# EAGLE design battery_monitor_6803-2_Rev4-uno_shield (EAGLE 6.3)
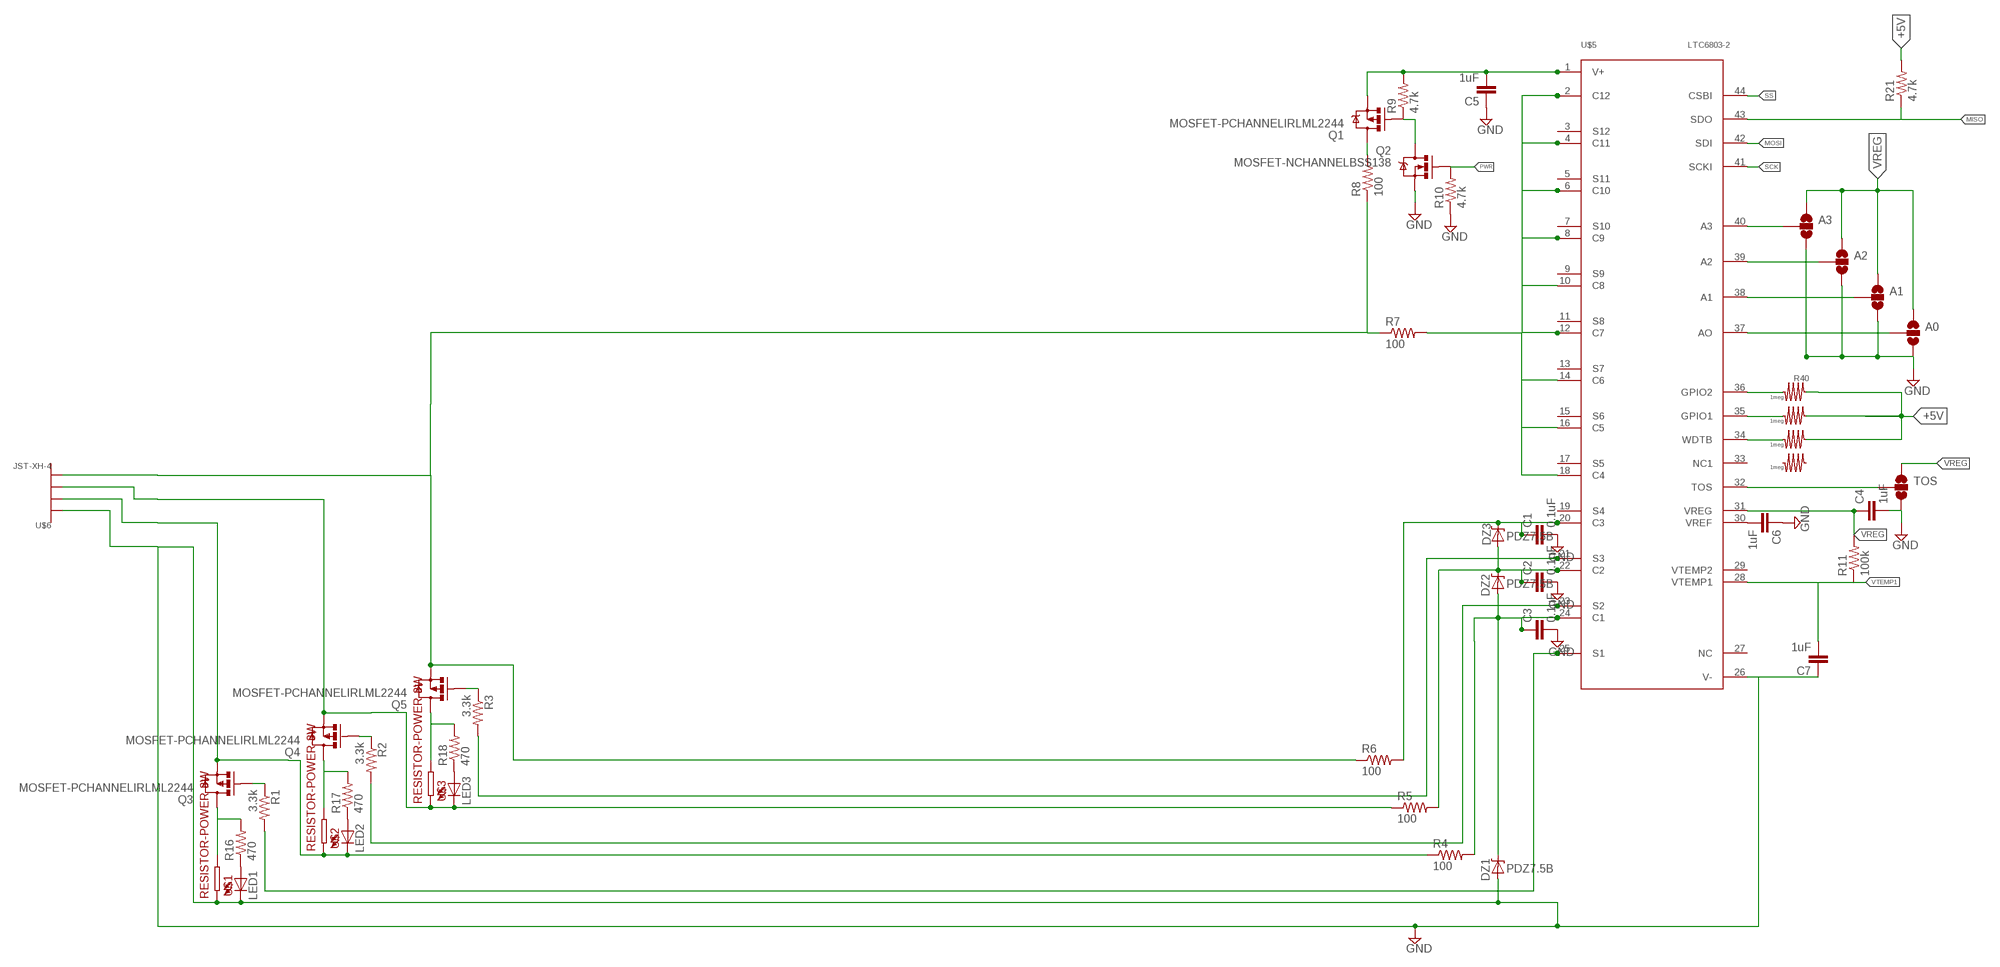
[diagram p0: schematic, sheet 1, part 1 of 2]
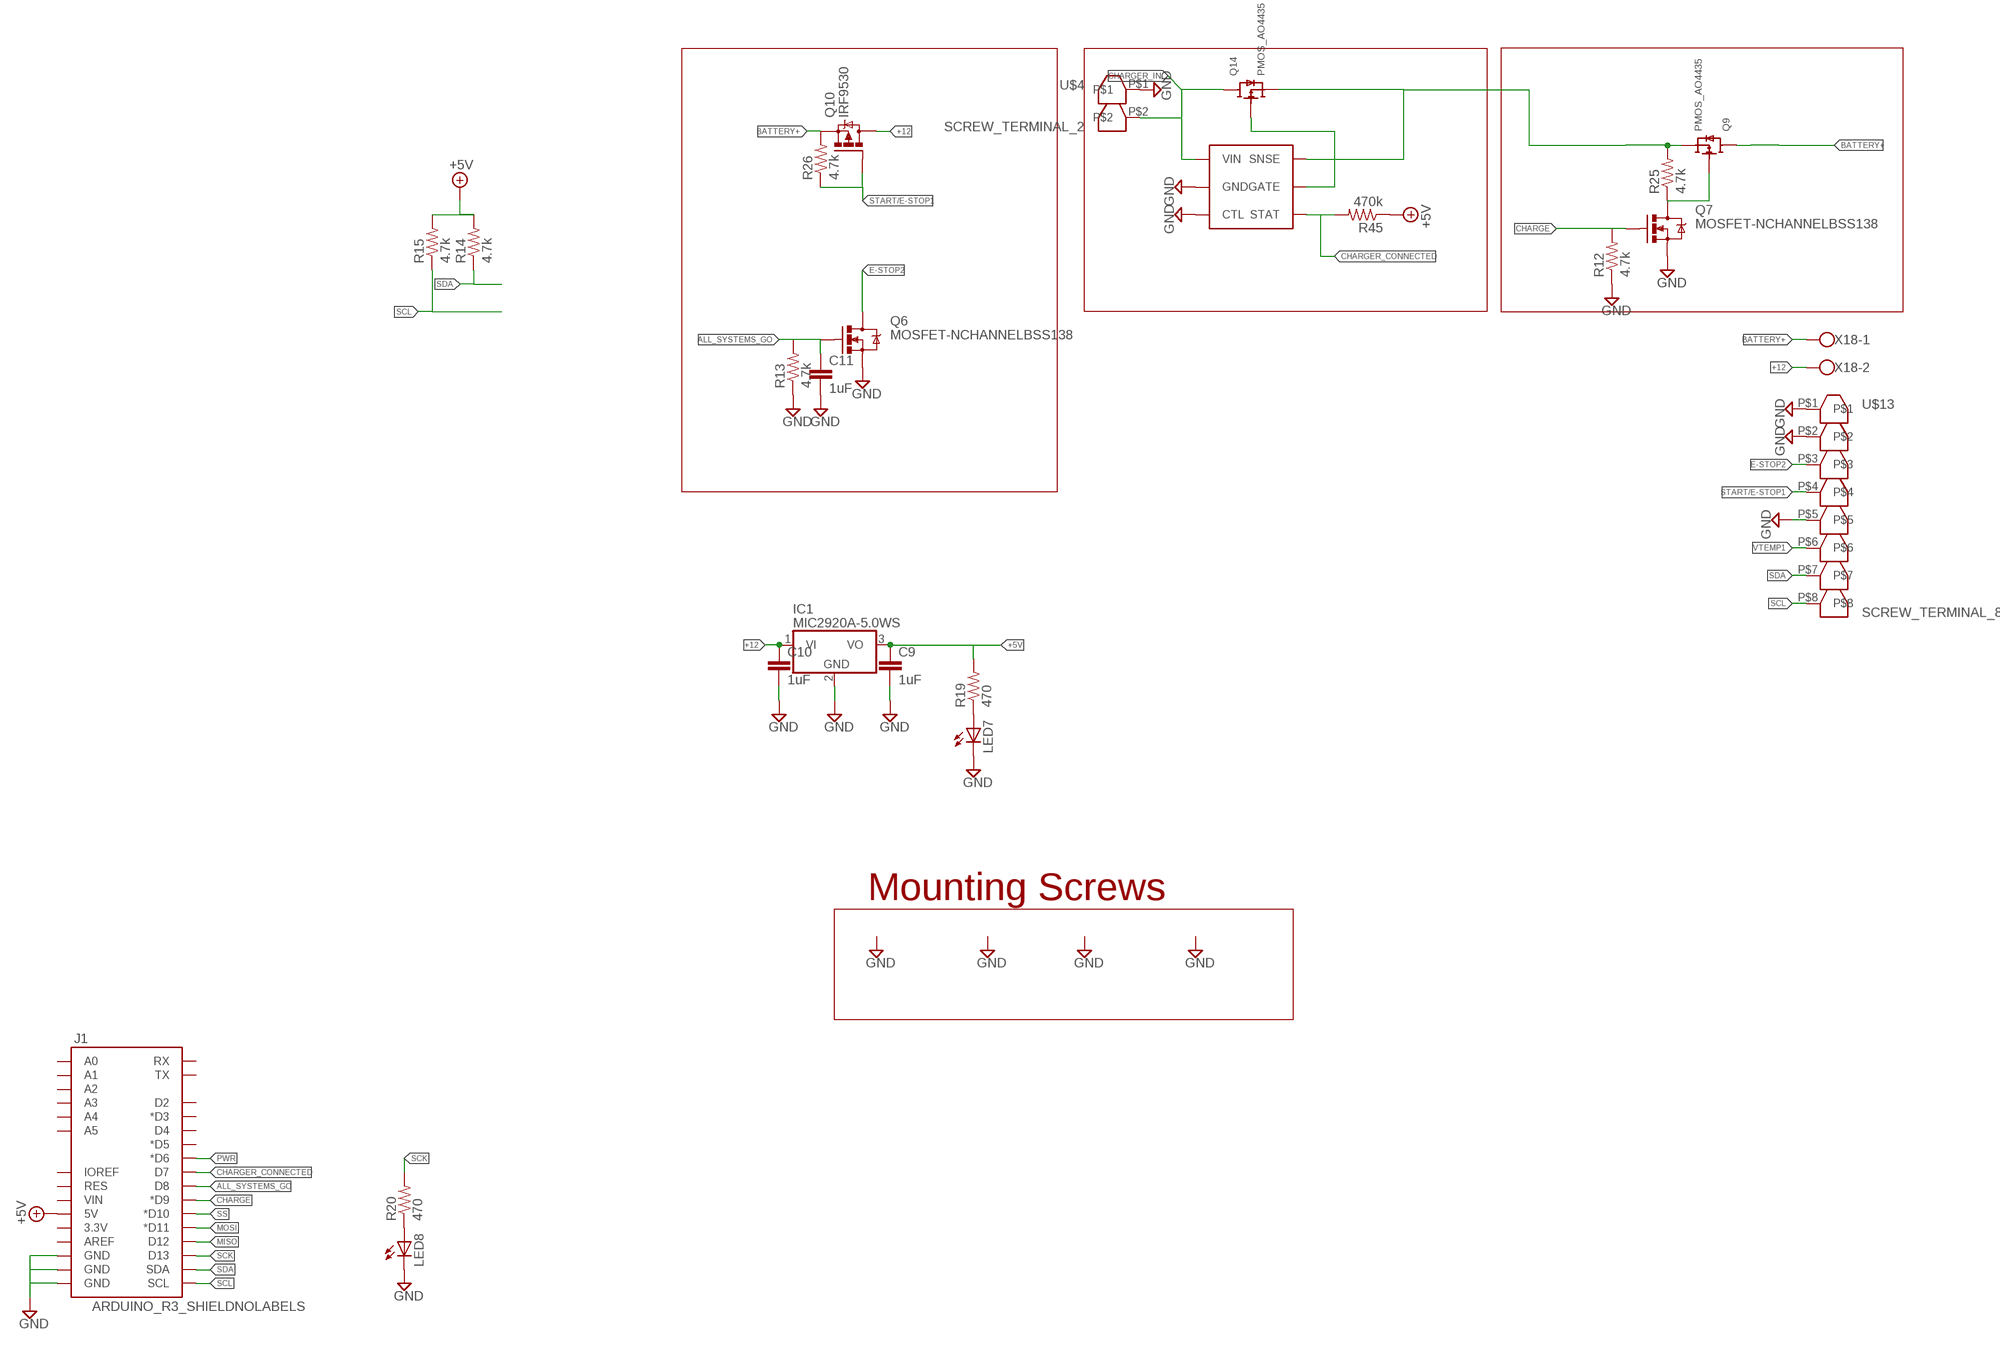
[diagram p1: schematic, sheet 1, part 2 of 2]

## Parts
A0  SOLDERJUMPER_2WAYS  [SJ_3]
A1  SOLDERJUMPER_2WAYS  [SJ_3]
A2  SOLDERJUMPER_2WAYS  [SJ_3]
A3  SOLDERJUMPER_2WAYS  [SJ_3]
C1  0.1uF  0.1UF-100V-10%(0603)  [0603-CAP]
C2  0.1uF  0.1UF-100V-10%(0603)  [0603-CAP]
C3  0.1uF  0.1UF-100V-10%(0603)  [0603-CAP]
C4  1uF  0.1UF-100V-10%(0603)  [0603-CAP]
C5  1uF  0.1UF-100V-10%(0603)  [0603-CAP]
C6  1uF  0.1UF-100V-10%(0603)  [0603-CAP]
C7  1uF  0.1UF-100V-10%(0603)  [0603-CAP]
C9  1uF  0.1UF-100V-10%(0603)  [0603-CAP]
C10  1uF  0.1UF-100V-10%(0603)  [0603-CAP]
C11  1uF  0.1UF-100V-10%(0603)  [0603-CAP]
DZ1  PDZ7.5B  DIODE-ZENER-BZT52  [SOD-323]
DZ2  PDZ7.5B  DIODE-ZENER-BZT52  [SOD-323]
DZ3  PDZ7.5B  DIODE-ZENER-BZT52  [SOD-323]
IC1  MIC2920A-5.0WS  MCP1703DB  [SOT223]
J1  ARDUINO_R3_SHIELDNOLABELS  [UNO_R3_SHIELD_NOLABELS]
LED1  LED0603  [LED-0603]
LED2  LED0603  [LED-0603]
LED3  LED0603  [LED-0603]
LED7  LED0603  [LED-0603]
LED8  LED0603  [LED-0603]
Q1  MOSFET-PCHANNELIRLML2244  [SOT23-3]
Q2  MOSFET-NCHANNELBSS138  [SOT23]
Q3  MOSFET-PCHANNELIRLML2244  [SOT23-3]
Q4  MOSFET-PCHANNELIRLML2244  [SOT23-3]
Q5  MOSFET-PCHANNELIRLML2244  [SOT23-3]
Q6  MOSFET-NCHANNELBSS138  [SOT23]
Q7  MOSFET-NCHANNELBSS138  [SOT23]
Q9  PMOS_AO4435  [SOIC8]
Q10  IRF9530  [TO220BV]
Q14  PMOS_AO4435  [SOIC8]
R1  3.3k  3.3KOHM1/10W1%(0603)  [0603-RES]
R2  3.3k  3.3KOHM1/10W1%(0603)  [0603-RES]
R3  3.3k  3.3KOHM1/10W1%(0603)  [0603-RES]
R4  100  3.3KOHM1/10W1%(0603)  [0603-RES]
R5  100  3.3KOHM1/10W1%(0603)  [0603-RES]
R6  100  3.3KOHM1/10W1%(0603)  [0603-RES]
R7  100  3.3KOHM1/10W1%(0603)  [0603-RES]
R8  100  3.3KOHM1/10W1%(0603)  [0603-RES]
R9  4.7k  3.3KOHM1/10W1%(0603)  [0603-RES]
R10  4.7k  3.3KOHM1/10W1%(0603)  [0603-RES]
R11  100k  3.3KOHM1/10W1%(0603)  [0603-RES]
R12  4.7k  3.3KOHM1/10W1%(0603)  [0603-RES]
R13  4.7k  3.3KOHM1/10W1%(0603)  [0603-RES]
R14  4.7k  3.3KOHM1/10W1%(0603)  [0603-RES]
R15  4.7k  3.3KOHM1/10W1%(0603)  [0603-RES]
R16  470  3.3KOHM1/10W1%(0603)  [0603-RES]
R17  470  3.3KOHM1/10W1%(0603)  [0603-RES]
R18  470  3.3KOHM1/10W1%(0603)  [0603-RES]
R19  470  3.3KOHM1/10W1%(0603)  [0603-RES]
R20  470  3.3KOHM1/10W1%(0603)  [0603-RES]
R21  4.7k  3.3KOHM1/10W1%(0603)  [0603-RES]
R25  4.7k  3.3KOHM1/10W1%(0603)  [0603-RES]
R26  4.7k  3.3KOHM1/10W1%(0603)  [0603-RES]
R40  1meg  RESISTOR-742C083  [RESISTOR-ARRAY-0603]
R45  470k  3.3KOHM1/10W1%(0603)  [0603-RES]
TOS  SOLDERJUMPER_2WAYS  [SJ_3]
U$1  RESISTOR-POWER-3W  [RESISTOR-3W]
U$2  RESISTOR-POWER-3W  [RESISTOR-3W]
U$3  RESISTOR-POWER-3W  [RESISTOR-3W]
U$4  SCREW_TERMINAL_2  [SCREW_TERMINAL_2]
U$5  LTC6803-2  [FSOP-44]
U$6  JST-XH-4  [JST-XH-4]
U$12  LTC4412  [SOT-23-6]
U$13  SCREW_TERMINAL_8  [SCREW_TERMINAL_8]
X18  W237-102  [W237-102]

## Nets
+5V: C9.1 IC1.3(VO) J1.5V R14.2 R15.2 R19.2 R21.2 R40.P$1 R40.P$3 R40.P$5 R45.1
+12: C10.1 IC1.1(VI) Q10.D X18.2
ALL_SYSTEMS_GO: C11.1 J1.D8 Q6.1(G) R13.2
BATTERY+: Q9.5(DRAIN) Q9.6(DRAIN) Q9.7(DRAIN) Q9.8(DRAIN) Q10.S R26.2 X18.1
CHARGE: J1.D9(*D9) Q7.1(G) R12.2
CHARGER_CONNECTED: J1.D7 R45.2 U$12.P$4(STAT)
CHARGER_IN: Q14.5(DRAIN) Q14.6(DRAIN) Q14.7(DRAIN) Q14.8(DRAIN) U$4.P$2 U$12.P$1(VIN)
E-STOP2: Q6.3(D) U$13.P$3
GND: A0.3 A1.3 A2.3 A3.3 C1.2 C2.2 C3.2 C4.2 C5.1 C6.1 C7.1 C9.2 C10.2 C11.2 DZ1.2(A) IC1.2(GND) J1.GND@0(GND) J1.GND@1(GND) J1.GND@2(GND) LED1.C LED7.C LED8.C Q2.2(S) Q6.2(S) Q7.2(S) R10.1 R12.1 R13.1 TOS.3 U$1.P$2 U$4.P$1 U$5.26(V-) U$6.P$4 U$12.P$2(GND) U$12.P$3(CTL) U$13.P$1 U$13.P$2 U$13.P$5
MISO: J1.D12 R21.1 U$5.43(SDO)
MOSI: J1.D11(*D11) U$5.42(SDI)
N$1: Q7.3(D) Q9.4(GATE) R25.1
N$2: LED2.C Q3.2(S) R4.1 U$2.P$2 U$6.P$3
N$3: LED3.C Q4.2(S) R5.1 U$3.P$2 U$6.P$2
N$4: Q5.2(S) R6.1 R7.1 R8.1 U$6.P$1
N$5: Q3.3(D) R16.2 U$1.P$1
N$6: R2.2 U$5.23(S2)
N$7: Q3.1(G) R1.1
N$8: R1.2 U$5.25(S1)
N$9: R3.2 U$5.21(S3)
N$10: Q4.3(D) R17.2 U$2.P$1
N$11: Q4.1(G) R2.1
N$12: Q5.3(D) R18.2 U$3.P$1
N$13: LED1.A R16.1
N$14: C1.1 DZ3.1(C) R6.2 U$5.20(C3)
N$15: C3.1 DZ1.1(C) DZ2.2(A) R4.2 U$5.24(C1)
N$16: C2.1 DZ2.1(C) DZ3.2(A) R5.2 U$5.22(C2)
N$17: R7.2 U$5.2(C12) U$5.4(C11) U$5.6(C10) U$5.8(C9) U$5.10(C8) U$5.12(C7) U$5.14(C6) U$5.16(C5) U$5.18(C4)
N$18: Q1.3(D) R8.2
N$19: C5.2 Q1.2(S) R9.2 U$5.1(V+)
N$20: Q1.1(G) Q2.3(D) R9.1
N$21: LED7.A R19.1
N$22: LED2.A R17.1
N$23: LED3.A R18.1
N$24: R40.P$2 U$5.36(GPIO2)
N$25: R40.P$4 U$5.35(GPIO1)
N$27: R40.P$6 U$5.34(WDTB)
N$28: A3.2 U$5.40(A3)
N$29: Q5.1(G) R3.1
N$30: A2.2 U$5.39(A2)
N$31: A1.2 U$5.38(A1)
N$32: A0.2 U$5.37(AO)
N$33: TOS.2 U$5.32(TOS)
N$34: C6.2 U$5.30(VREF)
N$35: LED8.A R20.1
N$60: Q9.1(SOURCE) Q9.2(SOURCE) Q9.3(SOURCE) Q14.1(SOURCE) Q14.2(SOURCE) Q14.3(SOURCE) R25.2 U$12.P$6(SNSE)
N$67: Q14.4(GATE) U$12.P$5(GATE)
PWR: J1.D6(*D6) Q2.1(G) R10.2
SCK: J1.D13 R20.2 U$5.41(SCKI)
SCL: J1.SCL R15.1 U$13.P$8
SDA: J1.SDA R14.1 U$13.P$7
SS: J1.D10(*D10) U$5.44(CSBI)
START/E-STOP1: Q10.G R26.1 U$13.P$4
VREG: A0.1 A1.1 A2.1 A3.1 C4.1 R11.2 TOS.1 U$5.31(VREG)
VTEMP1: C7.2 R11.1 U$5.28(VTEMP1) U$13.P$6
Unconnected: J1.3.3V J1.A0 J1.A1 J1.A2 J1.A3 J1.A4 J1.A5 J1.AREF J1.D2 J1.D3(*D3) J1.D4 J1.D5(*D5) J1.IOREF J1.RES J1.RX J1.TX J1.VIN R40.P$7 R40.P$8 U$5.3(S12) U$5.5(S11) U$5.7(S10) U$5.9(S9) U$5.11(S8) U$5.13(S7) U$5.15(S6) U$5.17(S5) U$5.19(S4) U$5.27(NC) U$5.29(VTEMP2) U$5.33(NC1)

## Notes on the sheet
- Mounting Screws

## Library data of the parts
A0 A1-A3 TOS = SparkFun:SOLDERJUMPER_2WAY: Solder Jumper 2 way solder jumper
C1-C3 = SparkFun-Capacitors:0.1UF-100V-10%(0603): CAP-08390; PROD_ID: CAP-08390
C4-C7 C9-C11 = SparkFun-Capacitors:0.1UF-100V-10%(0603): CAP-08390; PROD_ID: CAP-08390; VALUE: 0.1uF
DZ1-DZ3 = SparkFun-DiscreteSemi:DIODE-ZENER: Zener Diode Production Part - 8199 3.4V Zener Voltage
IC1 = linear:MCP1703: 250 mA, 16V, Low Quiescent Current LDO Regulator Source: http://ww1.microchip.com/downloads/en/DeviceDoc/22049b.pdf
J1 = SparkFun-Boards:ARDUINO_R3_SHIELD: Shield form compatible with the Arduino Uno R3.
LED1-LED3 LED7 LED8 = SparkFun-LED:LED: LEDs Standard schematic elements and footprints for 5mm, 3mm, 1206, and 0603 sized LEDs. 5mm - Spark Fun Electronics SKU : COM-00529 (and others)
Q1 Q3-Q5 = SparkFun-DiscreteSemi:MOSFET-PCHANNEL: Generic PMOSFET; PROD_ID: TRANS-11153
Q2 Q6 Q7 = SparkFun-DiscreteSemi:MOSFET-NCHANNEL: Common NMOSFET Parts MFG P/N Store ID Prod ID FDD8780 TRANS-09984 SI7820DN TRANS-11055 FDS6630A IC-08089 2N7002PW TRANS-11151 FQP30N06L COM-10213 TRANS-10060 BSS123LT1G TRANS-08345 BSS138 TRANS-00830 BS170 2N7000; PROD_ID: TRANS-00830
Q9 Q14 = isaac1:PMOS_AO4435
Q10 = Adams Chips:IRF9530: P-CHANNEL HEXFET POWER-MOS-FET Source: http://www.irf.com/product-info/datasheets/data/irf9530.pdf
R1-R21 R25 R26 R45 = SparkFun-Resistors:3.3KOHM1/10W1%(0603): RES-07851; PROD_ID: RES-07851
R40 = isaac1:RESISTOR-742C083
U$1-U$3 = isaac1:RESISTOR-POWER-3W: PR03 series .205" dia x .657" L
U$4 = isaac1:SCREW_TERMINAL_2
U$5 = isaac1:LTC6803-2
U$6 = isaac:JST-XH-4
U$12 = isaac1:LTC4412
U$13 = isaac1:SCREW_TERMINAL_8
X18 = con-wago-500:W237-102: WAGO SCREW CLAMP; MPN: 237-102; OC_FARNELL: unknown; OC_NEWARK: 70K9898

## Board
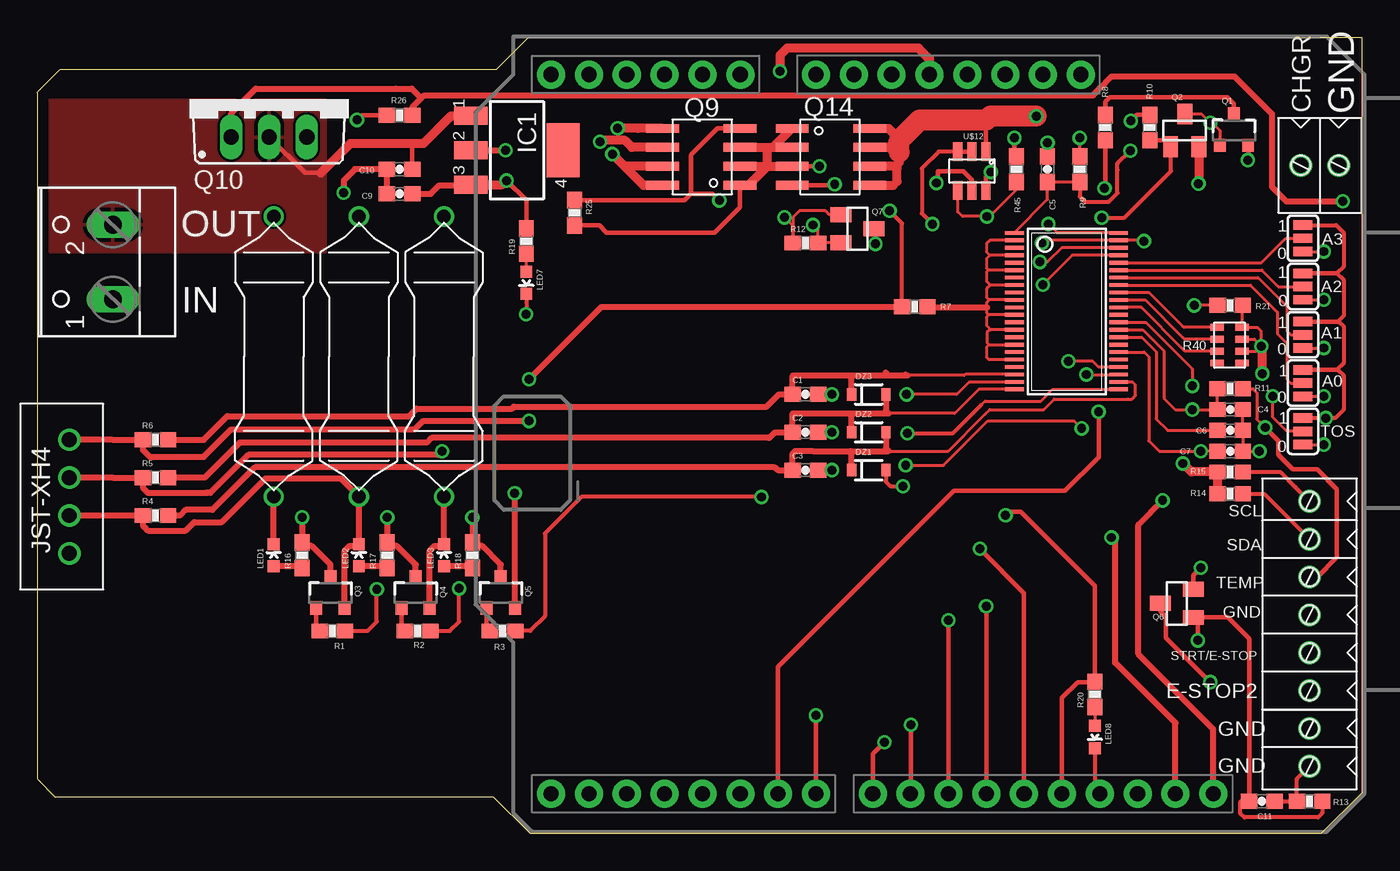
[diagram p2: board, top side]
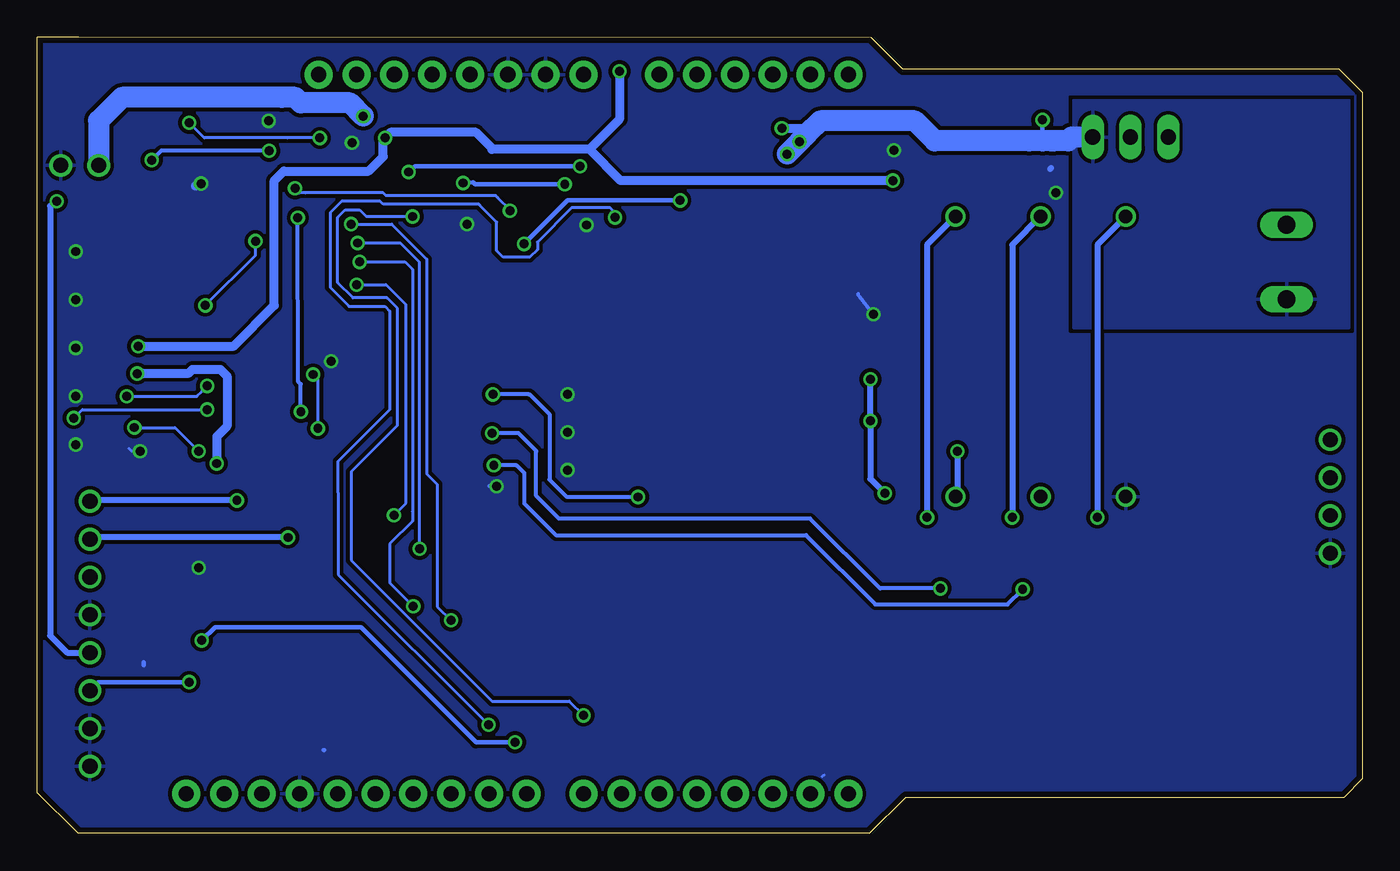
[diagram p3: board, bottom side, seen from below]

Size 88.94 x 53.43 mm. Coordinates in mm from the lower left corner, seen from the top.
Outline: 88.94,2.74 88.94,53.43
Outline: 88.94,53.43 86.15,53.43 32.95,53.4 30.82,51.27 1.56,51.3 0,49.74 0,49.73 0,3.66 1.22,2.44 30.63,2.44 33.07,0 86.2,0 86.2,0 88.94,2.74
Copper layers (1*16): Top 0.0356mm / dielectric 1.5011mm / Bottom 0.0356mm
Design rules "LaenPCBOrder *": minimum track width 6mil, minimum drill 13mil, track to track 6mil, track to pad 6mil, pad to pad 6mil, via to via 6mil, smd to smd 0mil, copper to edge 15mil, drill to drill 6mil, minimum pad ring 7mil, minimum via ring 7mil, stop-mask expansion 4mil, vias tented up to drill 25mil, thermal gap 10mil

### Footprints (pad centres in the part's own frame; a part is rotated, then mirrored left to right if it is on the bottom)
SJ_3 = smd 0.635 x 1.27: 1 -0.889,0; 2 0,0; 3 0.889,0
0603-CAP = smd 1.1 x 1: 1 -0.85,0; 2 0.85,0
SOD-323 = smd 0.63 x 0.83: 1 -1.15,0; 2 1.15,0
SOT223 = smd 1.219 x 2.235: 1 -2.311,-3.099; 2 0,-3.099; 3 2.311,-3.099 | smd 3.6 x 2.2: 4 0,3.099
UNO_R3_SHIELD_NOLABELS = drill 1.016 pad 1.88: 3.3V 50.8,26.67; 5V 50.8,29.21; A0 50.8,41.91; A1 50.8,44.45; A2 50.8,46.99; A3 50.8,49.53; A4 50.8,52.07; A5 50.8,54.61; AREF 2.54,15.24; D2 2.54,49.53; D3 2.54,46.99; D4 2.54,44.45; D5 2.54,41.91; D6 2.54,39.37; D7 2.54,36.83; D8 2.54,33.02; D9 2.54,30.48; D10 2.54,27.94; D11 2.54,25.4; D12 2.54,22.86; D13 2.54,20.32; GND@0 50.8,31.75; GND@1 50.8,34.29; GND@2 2.54,17.78; IOREF 50.8,21.59; NC 50.8,19.05; RES 50.8,24.13; RX 2.54,54.61; SCL 2.54,10.16; SDA 2.54,12.7; TX 2.54,52.07; VIN 50.8,36.83
LED-0603 = smd 0.8 x 0.8: A 0,-0.75; C 0,0.75
SOT23-3 = smd 0.8 x 0.9: 1 -0.95,-1; 2 0.95,-1; 3 0,1.1
SOT23 = smd 1 x 1.4: 1 -0.95,-1.1; 2 0.95,-1.1; 3 0,1.1
SOIC8 = smd 0.6 x 2.2: 1 -1.905,-2.54; 2 -0.635,-2.54; 3 0.635,-2.54; 4 1.905,-2.54; 5 1.905,2.66; 6 0.635,2.66; 7 -0.635,2.66; 8 -1.905,2.66
TO220BV = drill 1.016 long: D 0,-2.54; G -2.54,-2.54; S 2.54,-2.54
0603-RES = smd 1.1 x 1: 1 -0.85,0; 2 0.85,0
RESISTOR-ARRAY-0603 = smd 0.45 x 0.9: P$1 -1.2,0.85; P$2 -1.2,-0.85; P$3 -0.4,0.85; P$4 -0.4,-0.85; P$5 0.4,0.85; P$6 0.4,-0.85; P$7 1.2,0.85; P$8 1.2,-0.85
RESISTOR-3W = drill 0.9: P$1 0,9.398; P$2 0,-9.398
SCREW_TERMINAL_2 = drill 1.016 pad 1.422: P$1 0,1.27; P$2 0,-1.27
FSOP-44 = smd 0.25 x 1.25: 1 -5.25,-3.5; 2 -4.75,-3.5; 3 -4.25,-3.5; 4 -3.75,-3.5; 5 -3.25,-3.5; 6 -2.75,-3.5; 7 -2.25,-3.5; 8 -1.75,-3.5; 9 -1.25,-3.5; 10 -0.75,-3.5; 11 -0.25,-3.5; 12 0.25,-3.5; 13 0.75,-3.5; 14 1.25,-3.5; 15 1.75,-3.5; 16 2.25,-3.5; 17 2.75,-3.5; 18 3.25,-3.5; 19 3.75,-3.5; 20 4.25,-3.5; 21 4.75,-3.5; 22 5.25,-3.5; 23 5.25,3.5; 24 4.75,3.5; 25 4.25,3.5; 26 3.75,3.5; 27 3.25,3.5; 28 2.75,3.5; 29 2.25,3.5; 30 1.75,3.5; 31 1.25,3.5; 32 0.75,3.5; 33 0.25,3.5; 34 -0.25,3.5; 35 -0.75,3.5; 36 -1.25,3.5; 37 -1.75,3.5; 38 -2.25,3.5; 39 -2.75,3.5; 40 -3.25,3.5; 41 -3.75,3.5; 42 -4.25,3.5; 43 -4.75,3.5; 44 -5.25,3.5
JST-XH-4 = drill 1: P$1 0,-1.27; P$2 0,1.27; P$3 0,3.81; P$4 0,6.35
SOT-23-6 = smd 0.62 x 1.22: P$1 -0.95,-1.31; P$2 0,-1.31; P$3 0.95,-1.31; P$4 0.95,1.31; P$5 0,1.31; P$6 -0.95,1.31
SCREW_TERMINAL_8 = drill 1.016 pad 1.422: P$1 0,8.89; P$2 0,6.35; P$3 0,3.81; P$4 0,1.27; P$5 0,-1.27; P$6 0,-3.81; P$7 0,-6.35; P$8 0,-8.89
W237-102 = drill 1.194 long: 1 -2.5,-1.27; 2 2.5,-1.27

### Placement (x,y rotation side)
A0  84.96,30.23 270 top
A1  84.96,33.46 270 top
A2  84.96,36.7 270 top
A3  84.96,39.94 270 top
C1  51.56,29.46 0 top
C2  51.56,26.92 0 top
C3  51.56,24.38 0 top
C4  80.07,28.45 0 top
C5  67.82,44.58 270 top
C6  80.07,27.05 180 top
C7  80.07,25.65 180 top
C9  24.32,42.93 180 top
C10  24.32,44.58 180 top
C11  82.21,2.16 0 top
DZ1  55.82,24.38 0 top
DZ2  55.82,26.92 0 top
DZ3  55.82,29.46 0 top
IC1  32.19,45.85 270 top
J1  89.1,0.13 90 top
LED1  15.88,18.67 0 top
LED2  21.59,18.67 0 top
LED3  27.3,18.67 0 top
LED7  32.83,36.96 180 top
LED8  70.99,6.48 180 top
Q1  80.33,47.18 0 top
Q2  77.03,47.18 0 top
Q3  19.68,16.13 0 top
Q4  25.4,16.13 0 top
Q5  31.11,16.13 0 top
Q6  76.49,15.44 90 top
Q7  55.05,40.58 270 top
Q9  44.64,45.4 90 top
Q10  15.56,49.28 0 top
Q14  53.21,45.4 270 top
R1  19.81,13.59 0 top
R2  25.53,13.59 0 top
R3  31.24,13.59 0 top
R4  7.94,21.34 0 top
R5  7.94,23.88 0 top
R6  7.94,26.42 0 top
R7  58.9,35.34 0 top
R8  71.69,47.37 90 top
R9  69.98,44.58 270 top
R10  74.68,47.37 270 top
R11  80.07,29.84 180 top
R12  51.56,39.62 180 top
R13  85.41,2.16 0 top
R14  80.07,22.8 180 top
R15  80.07,24.26 180 top
R16  17.78,18.67 90 top
R17  23.5,18.67 90 top
R18  29.21,18.67 90 top
R19  32.83,39.75 90 top
R20  70.99,9.33 90 top
R21  80.07,35.43 0 top
R25  36.07,41.66 270 top
R26  24.32,48.2 180 top
R40  80.04,32.77 270 top
R45  65.72,44.58 270 top
TOS  84.96,26.99 270 top
U$1  15.88,32 0 top
U$2  21.59,32 0 top
U$3  27.3,32 0 top
U$4  86.09,44.83 270 top
U$5  69.09,35.05 270 top
U$6  2.16,25.15 180 top
U$12  62.74,44.45 180 top
U$13  85.41,13.4 180 top
X18  3.81,38.35 90 top

### Tracks (layer width: path | path; a pad name or v marks a point on that pad's centre or on a via)
+5V  (via drill 0.6)
  Top 0.203: R40.P$5 81.83,32.37 v82.17,32.7 | R40.P$3 81.71,33.17 v82.17,32.7 | v82.17,32.7 82.14,32.73 82.14,33.73 81.91,33.97 R40.P$1 80.89,35.4 R21.2
  Top 0.305: v65.6,46.67 65.6,45.55 R45.1 | 29.06,43.5 IC1.3 | R19.2 32.83,42.48 v31.5,43.81
  Top 0.406: IC1.3 29.06,43.5 26.99,43.5 26.42,42.93 C9.1 | R19.2 32.85,40.58
  Top 0.61: IC1.3 31.22,43.54 v31.5,43.81 | v76.9,24.83 77.47,24.26 R15.2 R14.2 79.14,22.71 | v82.23,30.86 82.23,32.64 v82.17,32.7 | J1.5V 59.89,51.97 59.16,52.7 50.34,52.7 49.86,52.22 v49.86,51.16
  Bottom 0.203: 65.72,46.55 v65.6,46.67
  Bottom 0.305: 65.47,46.55 v65.6,46.67
  Bottom 0.61: v31.5,43.81 49.78,43.81 51.88,45.91 | 51.88,45.91 58.42,45.91 58.42,45.97 59.49,47.04 65.23,47.04 v65.6,46.67 | 65.72,46.55 R45.1 66.7,44.45 72.39,44.45 73.03,43.81 73.03,35.43 75.75,32.7 v82.17,32.7 | v82.23,30.86 82.21,30.89 78.77,30.89 78.51,31.14 76.66,31.14 76.2,30.68 76.2,27.33 76.9,26.63 v76.9,24.83 | v49.86,51.16 49.86,47.93 51.88,45.91
+12
  Top 0.305: 29.07,48.13 IC1.1 | 19.05,44.32 17.97,44.32 Q10.D | C10.1 25.17,46.19 25.27,46.29
  Top 0.61: 29.07,48.13 27.75,48.13 26.99,47.37 25.91,46.29 25.27,46.29 21.02,46.29 19.05,44.32
  pour Top: 0.83,39.05 19.37,39.05 19.37,49.21 0.83,49.21
ALL_SYSTEMS_GO  (via drill 0.6)
  Top 0.254: R13.2 86.26,1.36 85.98,1.08 81.03,1.08 80.77,1.33 80.77,2.13 C11.1
  Top 0.305: C11.1 81.36,13.08 79.93,14.5 77.6,14.5 Q6.1 77.9,14.18 v77.9,12.95 | J1.D8 56.08,5.33 v56.87,6.12
  Bottom 0.305: v56.87,6.12 59.49,6.12 67.21,13.84 77.01,13.84 v77.9,12.95
BATTERY+  (via drill 0.6)
  Top 0.305: R26.2 22.61,48.2 21.78,48.2 v21.46,47.88
  Top 0.61: Q9.5 40.32,47.31 38.98,47.31 v38.96,47.32 | Q9.7 39.43,44.77 v38.61,45.59 40.7,43.5 Q9.8 | Q9.6 39.92,46.04 39.45,46.51 37.87,46.51 v37.78,46.42
  Bottom 0.203: Q10.S 19.62,46.74 | 20.89,46.48 20.7,46.48
  Bottom 0.305: 21.46,46.99 v21.46,47.88 21.46,46.99 | 21.46,46.99 21.46,46.48
  Bottom 0.61: v37.78,46.42 37.43,46.77 | v38.96,47.32 37.64,47.32 37.26,46.94
  Bottom 1.422: Q10.S 19.49,46.74 19.75,46.48 20.7,46.48 20.89,46.48 21.46,46.48 22.35,46.48 28.7,46.48 30.04,47.82 36.39,47.82 37.26,46.94 37.43,46.77 v37.78,46.42 v38.61,45.59
  pour Bottom (isolate 0.203): 0.89,33.91 19.37,33.91 19.37,49.21 0.89,49.21
CHARGE  (via drill 0.6)
  Top 0.203: Q7.1 53.15,41.53 52.9,41.78 51.18,41.78 50.74,41.34 50.74,39.75 | 50.74,39.75 50.74,39.65 R12.2 | 50.74,39.75 50.74,40.77 v50.16,41.34
  Top 0.305: v58.65,7.29 58.65,2.69 J1.D9
  Bottom 0.203: v50.16,41.34 50.16,41.66 50.48,41.97 53.09,41.97 55.37,39.69 55.37,39.18 55.88,38.67 57.66,38.67 58.1,39.12 58.1,41.02 59.24,42.16 59.31,42.23 65.72,42.23 65.91,42.42 68.52,42.42 69.28,41.66 69.28,36.64 68.01,35.37 65.6,35.37 65.28,35.05 65.28,28.45 68.73,24.99 68.73,22.86 68.73,17.37 v58.65,7.29
CHARGER_CONNECTED  (via drill 0.6)
  Top 0.203: R45.2 65.72,43.18 63.94,41.4 v63.75,41.4 62.1,41.4 61.78,41.72 U$12.P$4 | U$12.P$4
  Top 0.305: v52.27,7.92 J1.D7
  Bottom 0.203: v63.75,41.4 66.86,41.4 67.31,41.85 68.26,41.85 68.77,41.34 68.77,36.96 67.75,35.94 65.47,35.94 64.77,35.24 64.77,28.52 64.77,27.38 67.87,24.28 67.87,18.34 58.42,8.89 53.24,8.89 v52.27,7.92
CHARGER_IN  (via drill 0.6)
  Top 0.305: 57.47,43.5 57.72,43.75 | 57.72,46.74 57.72,43.88 57.78,43.81 | U$12.P$1 63.69,47.88
  Top 0.61: Q14.8 57.15,47.31 57.72,46.74 57.72,46.23 57.53,46.04 | 57.53,46.04 Q14.7 57.53,46.04 | 57.53,46.04 57.85,45.72 57.85,45.02 57.59,44.77 | 57.59,44.77 Q14.6 | Q14.5 57.47,43.5 | 57.72,43.75 57.72,44.64 57.59,44.77
  Top 1.422: 57.85,45.72 57.85,46.48 59.24,47.88 63.69,47.88 64.01,48.13 v67.06,48.13
  Bottom 1.422: v67.06,48.13 67.94,49.02 71.25,49.02 71.63,49.4 72.52,49.4 83.25,49.4 84.82,47.83 U$4.P$2
E-STOP2  (via drill 0.6)
  Top 0.305: v78.74,10.16 75.77,13.13 75.77,14.53 75.39,14.9 Q6.3
  Bottom 0.305: U$13.P$3 84.84,10.16 v78.74,10.16
GND  (via drill 0.6)
  Top 0.203: U$5.26 71.25,31.3 70.87,31.69 v69.22,31.69 | C4.2 C6.1 C7.1 v82.04,25.65 | A3.3 v86.36,39.05 | A2.3 v86.36,35.81 | A1.3 v86.36,32.58 | A0.3 v86.36,29.34 | TOS.3 v86.36,26.1 | Q7.2 R12.1 52.41,40.49 v52.07,40.83 | C5.1 v67.82,46.35
  Top 0.254: DZ1.2 56.97,23.61 57.28,23.3 v58.1,23.3 | 60.75,45.76 U$12.P$3 U$12.P$2 60.52,45.76 59.38,44.63 59.38,41.6 v60.1,40.89 | LED7.C 32.83,35.62 v32.82,34.85 | C11.2 R13.1 84.56,3.66 U$13.P$1 | LED8.C 70.99,3 J1.GND@2
  Top 0.305: R10.1 73.81,48.22 v73.41,47.82 | Q6.2 77.59,17.32 v78.11,17.83
  Top 0.406: LED1.C U$1.P$2 | C1.2 v53.34,29.46 | C2.2 v53.34,26.92 | C3.2 v53.34,24.38 | IC1.2 v31.43,45.85 | C9.2 C10.2 21.34,44.58 20.57,43.81 v20.57,42.99
  Top 0.61: Q2.2 77.97,43.63 v77.95,43.61
  Bottom 0.203: v69.22,31.69 69.22,31.62 | v82.04,25.65 82.61,25.65 82.8,25.84 | v86.36,39.05 86.55,39.05 | v86.36,35.81 86.42,35.81 | v86.36,32.58 86.36,32.83 | v86.36,29.34 86.36,29.59 | v86.36,26.1 86.36,26.23 | v52.07,40.83 52.01,40.89 | v67.82,46.35 67.82,46.55 | 36.26,3.81 36.13,3.94
  Bottom 0.254: v58.1,23.3 58.61,23.3 | 69.72,5.59 69.66,5.59 | v32.82,34.85 33.85,36.2 | v60.1,40.89 60.3,40.89 60.35,40.95
  Bottom 0.305: 81.79,11.3 81.79,11.49 | v73.41,47.82 73.34,47.82 | v78.11,17.83 78.41,17.83 78.44,17.86
  Bottom 0.406: v53.34,29.46 53.53,29.46 53.59,29.4 | v53.34,26.92 53.4,26.92 | v53.34,24.38 53.4,24.45 | v31.43,45.85 31.43,45.91 | 20.89,44.64 20.95,44.58
  Bottom 0.61: v77.95,43.61 78.16,43.61 78.33,43.43
  pour Bottom (isolate 0.254, rank 2): -1.46,-2.1 165.1,-2.54 165.1,104.14 -1.27,104.14
MISO  (via drill 0.6)
  Top 0.203: v67.44,39.62 67.61,39.8 U$5.43 74.24,39.8 v74.3,39.75 | R21.1 v77.66,35.43
  Top 0.305: J1.D12 66.24,16.13 v63.27,19.1
  Bottom 0.203: v67.44,39.62 64.58,39.62 63.31,38.35 63.31,21.84 63.31,19.14 | v77.66,35.43 74.3,38.8 v74.3,39.75
  Bottom 0.254: 63.31,19.14 v63.27,19.1
MOSI  (via drill 0.6)
  Top 0.203: U$5.42 68.77,39.3 67.82,38.35 v67.31,38.35
  Top 0.305: v63.7,15.24 J1.D11
  Bottom 0.203: v67.31,38.35 64.26,38.35 63.75,37.85 63.75,21.59 63.75,20.95 65.28,19.43 65.28,16.82 v63.7,15.24
N$1  (via drill 0.6)
  Top 0.305: R25.1 43.46,42.51 43.88,42.93 | 43.88,42.93 43.88,45.53 45.66,47.31 Q9.4 | 43.88,42.93 45.34,42.93 v45.78,42.48 | v56.26,39.56 56.26,40.47 Q7.3
  Bottom 0.305: v45.78,42.48 53.34,42.48 v56.26,39.56
N$2
  Top 0.406: Q3.2 20.64,18.98 20.95,19.3 21.48,19.3 LED2.C U$2.P$2 20.38,23.81 15.3,23.81 12.38,20.89 10.54,20.89 9.97,20.32 7.43,20.32 7.18,20.57 7.09,20.66 R4.1 U$6.P$3
N$3  (via drill 0.6)
  Top 0.406: Q4.2 26.35,18.98 26.67,19.3 27.19,19.3 LED3.C U$3.P$2 | 11.3,22.86 7.43,22.86 7.09,23.2 R5.1 5.08,23.88 U$6.P$2 | 11.3,22.86 11.43,22.86 | 11.3,22.86 11.62,22.86 14.16,25.4 26.92,25.4 v27.18,25.65
  Bottom 0.406: v27.18,25.65 27.18,22.73 U$3.P$2
N$4  (via drill 0.6)
  Top 0.254: R7.1 58.05,40.94 v57.21,41.78
  Top 0.305: R8.1 71.69,45.15 71.69,43.34 v71.64,43.29
  Top 0.406: Q5.2 32.06,18.98 32.05,18.99 v32.05,22.84 | v33.02,27.69 25.91,27.69 25.34,27.11 13.02,27.11 11.18,25.27 7.56,25.27 7.43,25.4 7.09,25.74 R6.1 5.08,26.42 U$6.P$1 | v33.02,30.48 37.88,35.34 R7.1
  Bottom 0.203: v57.21,41.78 57.21,41.85 58.04,42.67 58.17,42.8 65.53,42.8 65.72,42.99 70.93,42.99 71.34,42.99 v71.64,43.29
  Bottom 0.406: v32.05,22.84 33.02,23.8 v33.02,27.69 v33.02,30.48
N$5  (via drill 0.6)
  Top 0.406: v17.78,21.21 R16.2 18,19.3 18.41,19.3 19.68,18.03 Q3.3
  Bottom 0.406: U$1.P$1 17.78,39.5 v17.78,21.21
N$6  (via drill 0.6)
  Top 0.203: 63.37,28.77 63.63,29.02 67.37,29.02 68.16,29.8 U$5.23
  Top 0.254: R2.2 27.69,13.59 28.32,14.22 v28.32,16.45 | v58.42,26.86 61.47,26.86 63.37,28.77
  Bottom 0.254: v58.42,26.86 56.64,26.86 55.44,25.65 55.45,25.64 55.45,22.66 53.92,21.13 37.06,21.13 32.37,16.45 v28.32,16.45
N$7
  Top 0.305: Q3.1 18.73,13.82 R1.1
N$8  (via drill 0.6)
  Top 0.203: v58.29,24.7 60.83,24.7 63.82,27.69 69.6,27.69 v70.1,27.18 | v70.42,30.8 U$5.25
  Top 0.254: R1.2 22.16,13.59 22.8,14.22 v22.8,16.38
  Bottom 0.203: v70.1,27.18 70.1,30.48 v70.42,30.8
  Bottom 0.254: v58.29,24.7 56.77,24.7 56.26,24.19 56.26,22.15 54.13,20.02 37.34,20.02 32.69,15.37 23.81,15.37 v22.8,16.38
N$9  (via drill 0.6)
  Top 0.203: U$5.21 65.58,30.29 62.55,30.29 61.72,29.46 v58.36,29.46
  Top 0.254: v48.62,22.58 36.52,22.58 34.09,20.14 34.09,14.58 33.1,13.59 R3.2
  Bottom 0.254: v58.36,29.46 55.94,29.46 55.88,29.46 54.56,28.14 54.56,23.75 53.42,22.61 48.64,22.61 v48.62,22.58
N$10  (via drill 0.6)
  Top 0.406: v23.5,21.21 R17.2 23.71,19.3 24.13,19.3 25.4,18.03 Q4.3
  Bottom 0.406: U$2.P$1 23.5,39.5 v23.5,21.21
N$11
  Top 0.305: Q4.1 24.45,13.82 R2.1
N$12  (via drill 0.6)
  Top 0.406: v29.21,21.21 R18.2 29.43,19.3 29.84,19.3 31.11,18.03 Q5.3
  Bottom 0.406: U$3.P$1 29.21,39.5 v29.21,21.21
N$13
  Top 0.406: R16.1 17.68,17.92 LED1.A
N$14
  Top 0.203: U$5.20 62.3,30.8 62.23,30.73 58.42,30.73
  Top 0.305: 58.29,30.86 58.42,30.73
  Top 0.406: 54.61,30.73 52.07,30.73 50.74,30.73 50.71,30.71 C1.1 49.78,29.46 48.96,28.64 32,28.64 31.88,28.51 25.46,28.51 24.96,28 12.76,28 11.18,26.42 R6.2 | 54.61,30.73 57.15,30.73 | 57.15,30.73 58.42,30.73 | DZ3.1 54.67,30.68 54.61,30.73 | 56.97,30.92 57.15,30.73
N$15
  Top 0.203: 57.15,25.65 61.15,25.65 63.63,28.13 63.94,28.45 67.56,28.45 68.26,29.15 73.22,29.15 73.47,29.15 73.72,29.4 73.72,30.1 73.52,30.3 U$5.24
  Top 0.406: 54.61,25.65 52.07,25.65 50.88,25.65 50.71,25.49 C3.1 49.72,24.38 49.53,24.57 49.47,24.57 14.61,24.57 11.75,21.72 9.97,21.72 9.59,21.34 R4.2 | 54.61,25.65 57.15,25.65 56.97,25.84 DZ2.2 | DZ1.1 54.67,25.6 54.61,25.65
N$16
  Top 0.203: U$5.22 63.2,29.8 61.59,28.19 57.15,28.19
  Top 0.406: 54.61,28.19 52.07,28.19 50.74,28.19 50.71,28.17 C2.1 49.53,26.92 49.15,26.54 49.09,26.54 26.48,26.54 26.16,26.23 13.59,26.23 11.24,23.88 R5.2 | 54.61,28.19 57.15,28.19 56.97,28.38 DZ3.2 | DZ2.1 54.67,28.14 54.61,28.19
N$17
  Top 0.203: U$5.2 63.93,39.8 63.75,39.62 63.75,38.99 63.94,38.8 | U$5.4 63.94,38.8 | U$5.6 63.86,37.8 | 63.86,37.8 63.75,37.91 63.75,38.62 63.94,38.8 | U$5.8 63.97,36.8 | 63.97,36.8 63.82,36.96 63.75,37.02 63.75,37.69 63.86,37.8 | U$5.10 63.89,35.8 | 63.89,35.8 63.75,35.94 63.75,36.58 63.97,36.8 | U$5.12 63.88,34.8 | 63.88,34.8 63.75,34.92 63.75,35.31 63.75,35.66 63.89,35.8 | U$5.18 63.88,31.8 63.75,31.93 63.75,32.66 63.88,32.79 | 63.88,32.79 65.58,32.79 U$5.16 | 63.88,32.79 63.75,32.92 63.75,33.66 63.9,33.8 U$5.14 64.01,33.8 63.75,34.06 63.75,34.68 63.88,34.8
  Top 0.406: R7.2 59.79,35.31 63.75,35.31
N$18
  Top 0.305: Q1.3 80.33,48.96 79.88,49.4 72.83,49.4 72.01,49.4 71.69,49.09 R8.2
N$19  (via drill 0.6)
  Top 0.203: U$5.1 65.59,40.31 67.82,42.55 C5.2 R9.2
  Top 0.254: R9.2 69.98,42.75 70.26,42.47 70.33,42.39 71.93,42.39 72.52,42.98 72.52,44.51 72.52,44.97 v73.37,45.82 | Q1.2 81.28,45.21 v81.25,45.19
  Bottom 0.254: v73.37,45.82 80.62,45.82 v81.25,45.19
N$20  (via drill 0.6)
  Top 0.203: R9.1 69.98,45.91 v69.98,46.67 | Q1.1 79.38,47.18 78.87,47.69 v78.74,47.69 78.15,48.28 Q2.3
  Bottom 0.203: v69.98,46.67 72.14,46.67 77.72,46.67 v78.74,47.69
N$21
  Top 0.203: LED7.A R19.1
N$22
  Top 0.406: R17.1 23.39,17.92 LED2.A
N$23
  Top 0.406: R18.1 29.11,17.92 LED3.A
N$24
  Top 0.203: U$5.36 74.63,36.3 76.9,34.04 76.97,33.97 R40.P$2
N$25
  Top 0.203: U$5.35 74.37,35.8 76.91,33.27 77.01,33.17 R40.P$4
N$27
  Top 0.203: U$5.34 74.11,35.31 76.91,32.51 77.04,32.37 R40.P$6
N$28
  Top 0.203: U$5.40 82.18,38.3 83.82,39.94 A3.2
N$29
  Top 0.305: Q5.1 30.16,13.82 R3.1
N$30
  Top 0.203: U$5.39 82.21,37.8 83.31,36.7 A2.2
N$31
  Top 0.203: U$5.38 81.95,37.3 83.88,35.37 83.88,33.72 84.14,33.47 A1.2
N$32
  Top 0.203: U$5.37 81.44,36.8 83.25,34.99 83.25,33.53 83.88,32.89 83.88,30.48 84.14,30.23 A0.2
N$33  (via drill 0.6)
  Top 0.203: TOS.2 83.88,26.99 82.93,27.94 v82.93,29.34 | U$5.32 74.41,34.3 77.53,31.18 v77.53,30.04
  Bottom 0.203: v82.93,29.34 78.23,29.34 77.88,29.69 v77.53,30.04
N$34
  Top 0.203: 79.06,26.95 C6.2 78.36,27.05 75.88,27.05 75.12,27.81 75.12,32.32 74.14,33.3 U$5.30
N$35
  Top 0.203: R20.1 LED8.A
N$60  (via drill 0.6)
  Top 0.305: R25.2 37.74,40.81 38.23,40.32 45.47,40.32 47.18,42.04 Q9.1 | Q14.3 52.45,44.77 v52.51,44.77 | U$12.P$6 63.69,44.07 v64.01,44.39
  Top 0.61: 48.96,46.04 Q9.3 48.96,46.04 | 48.96,46.04 Q14.2 | Q9.2 49.02,44.77 | 49.02,44.77 Q14.3 | Q9.1 47.75,43.5 49.02,44.77 | 48.96,46.04 49.4,46.04 Q14.1 | 49.02,44.77 49.02,45.97 48.96,46.04
  Bottom 0.305: v52.51,44.77 63.56,44.77 v64.01,44.39
N$67  (via drill 0.6)
  Top 0.305: Q14.4 53.47,43.5 v53.53,43.56 | U$12.P$5 62.74,43.88 62.17,44.45 60.45,44.45 60.41,43.65 v60.35,43.65
  Bottom 0.305: v53.53,43.56 59.56,43.56 59.69,43.69 v60.35,43.65
PWR  (via drill 0.6)
  Top 0.254: Q2.1 76.1,46.06 76.1,44.45 72.97,41.33 v71.45,41.33
  Top 0.305: R10.2 75.64,46.52 Q2.1 | J1.D6 49.73,11.2 61.52,22.99 68.99,22.99 71.25,25.25 v71.25,28.3
  Bottom 0.254: v71.25,28.3 71.25,30.15 71.42,30.33 v71.45,41.33
SCK  (via drill 0.6)
  Top 0.203: U$5.41 69.47,38.8 v67.5,36.83
  Top 0.254: R20.2
  Top 0.305: J1.D13 68.78,9.09 69.85,10.16 70.97,10.16 R20.2 70.99,16.64 66.04,21.59 65.23,21.59 v65,21.36
  Bottom 0.203: v67.5,36.83 65.53,36.83 64.26,35.56 64.19,35.48 64.19,22.17 v65,21.36
SCL  (via drill 0.6)
  Top 0.254: U$13.P$8 84.45,23.24 83.44,24.26 R15.1
  Top 0.406: J1.SCL 78.94,7.01 73.91,12.04 73.91,20.73 v75.54,22.35
  Bottom 0.406: v75.54,22.35 85.34,22.35 U$13.P$8
SDA  (via drill 0.6)
  Top 0.254: U$13.P$7 83.38,21.78 82.36,22.8 R14.1
  Top 0.406: J1.SDA 76.4,7.42 72.36,11.46 72.36,19.61 v72.11,19.86
  Bottom 0.406: v72.11,19.86 85.29,19.86 U$13.P$7
SS  (via drill 0.6)
  Top 0.203: U$5.44 68.47,40.3 v67.88,40.89 | v61.16,14.3 61.16,11.91
  Top 0.305: J1.D10 61.16,11.91 v61.16,14.3
  Bottom 0.203: v67.88,40.89 65.15,40.89 62.8,38.54 62.8,24.13 62.09,23.42 62.09,15.23 v61.16,14.3
START/E-STOP1  (via drill 0.6)
  Top 0.305: 25.21,48.24 R26.1
  Top 0.406: Q10.G 13.02,48.32 14.67,49.97 24.07,49.97 25.15,49.97 25.78,49.34 | 25.21,48.24 25.21,48.77 25.78,49.34 | 25.78,49.34 25.97,49.53 70.87,49.53 71.28,49.97 72.11,50.8 72.39,50.8 80.37,50.8 82.88,48.28 82.88,43.38 83.84,42.42 v87.63,42.42
  Bottom 0.406: U$13.P$4 86.93,12.13 88.08,13.27 88.08,42.1 87.76,42.42 v87.63,42.42
VREG  (via drill 0.6)
  Top 0.203: R11.2 C4.1 v77.53,28.45 76.39,28.45 75.63,29.21 75.63,32.38 74.21,33.8 U$5.31 | TOS.1 v86.49,27.88 | v86.49,27.88 87.12,27.88 v86.49,27.88
  Top 0.254: A3.1 87.19,40.83 87.69,40.32 87.69,38.04 87.25,37.59 | 87.25,37.59 A2.1 87.25,37.59 | 87.25,37.59 87.69,37.15 87.69,34.73 87.31,34.35 A1.1 87.38,34.35 87.69,34.04 87.69,31.56 87.25,31.11 A0.1 87.31,31.11 87.69,30.73 87.69,28.45 87.12,27.88 v86.49,27.88 TOS.1
  Bottom 0.203: v86.49,27.88 85.92,28.45 v77.53,28.45
VTEMP1  (via drill 0.6)
  Top 0.203: C7.2 v78.11,25.65 75.31,25.65 74.61,26.35 74.61,32 74.31,32.3 U$5.28 | 82.23,27.43 v82.42,27.24 81.85,27.81 81.85,29.59 81.79,29.65 81.6,29.84 R11.1
  Top 0.305: v82.42,27.24 83.31,26.35 83.31,25.4 84.26,24.45 85.92,24.45 87.25,23.11 87.25,18.54 85.92,17.21 U$13.P$6
  Bottom 0.203: v82.42,27.24 79.69,27.24 v78.11,25.65

### Text on the board
tPlace: CHGR | GND | OUT | 1 | 0 | 1 | IN | 0 | 1 | 0 | 1 | 0 | 1 | 0 | SCL | SDA | TEMP | GND | STRT/E-STOP | E-STOP2 | GND | GND